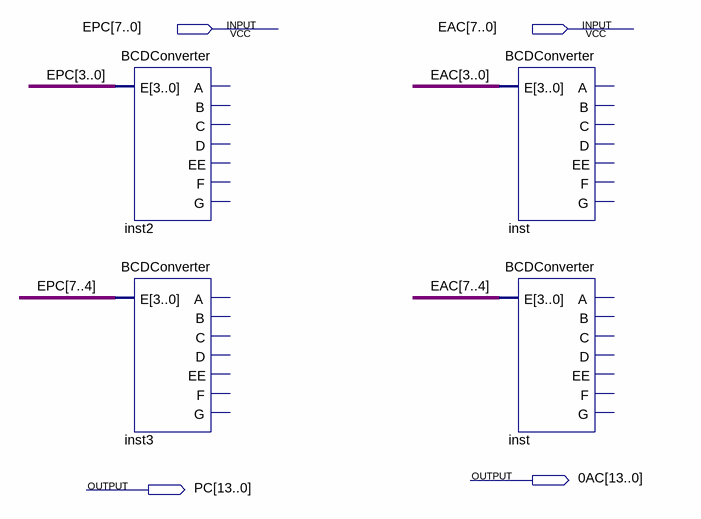
[diagram p0: schematic sheet]
// Quartus schematic DISPLAY.bdf as structural Verilog: 4 symbols, 4 pins
module DISPLAY (
  input  [7:0] EPC,
  input  [7:0] EAC,
  output [13:0] \0AC ,
  output [13:0] PC
);

  BCDConverter inst2 (.E(EPC[3:0]));  // open: A, B, C, D, EE, F, G
  BCDConverter inst3 (.E(EPC[7:4]));  // open: A, B, C, D, EE, F, G
  BCDConverter inst (.E(EAC[3:0]));  // open: A, B, C, D, EE, F, G
  BCDConverter inst_dup2 (.E(EAC[7:4]));  // open: A, B, C, D, EE, F, G
endmodule
